# Altium project CC2538+CC2592DK.PrjPcb
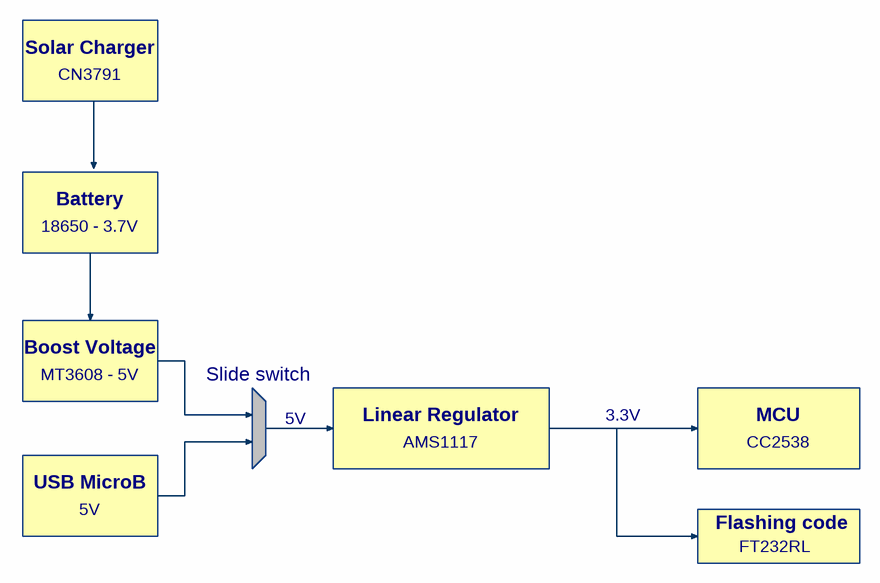
[diagram p0: [CC2538] Power Diagram.SchDoc]
5 sheets, 70 parts. Net scope: global (net labels, ports and power ports of the same name join across sheets).
Board files: [CC2538] PCB.PcbDoc, [CC2538] PCB Print.PcbDoc, [CC2538] PCB v2.PcbDoc, [CC2538] PCB v3.PcbDoc
Sheets:
  [CC2538] Power Diagram.SchDoc
  [CC2538] Power Circuit.SchDoc
  [CC2538] Flashing - FTDI.SchDoc
  [CC2538] MCU.SchDoc
  [CC2538] RTC.SchDoc

## Sheet [CC2538] Power Diagram.SchDoc
size 254 x 208 mm; Date: 10/04/2024; DrawnBy: TinhChau; Revision: 1; SheetNumber: 1; SheetTotal: 4

### Notes on the sheet
- Solar Charger
- CN3791
- Battery
- 18650 - 3.7V
- Boost Voltage
- MT3608 - 5V
- Slide switch
- 5V
- Linear Regulator
- 3.3V
- MCU
- USB MicroB
- AMS1117
- CC2538
- FT232RL
- Flashing code
- Title
- Size
- Date:
- A4
- Number
- Check by:
- Revision
- Sheet of:
- Draw by:

## Sheet [CC2538] Power Circuit.SchDoc
size 254 x 208 mm
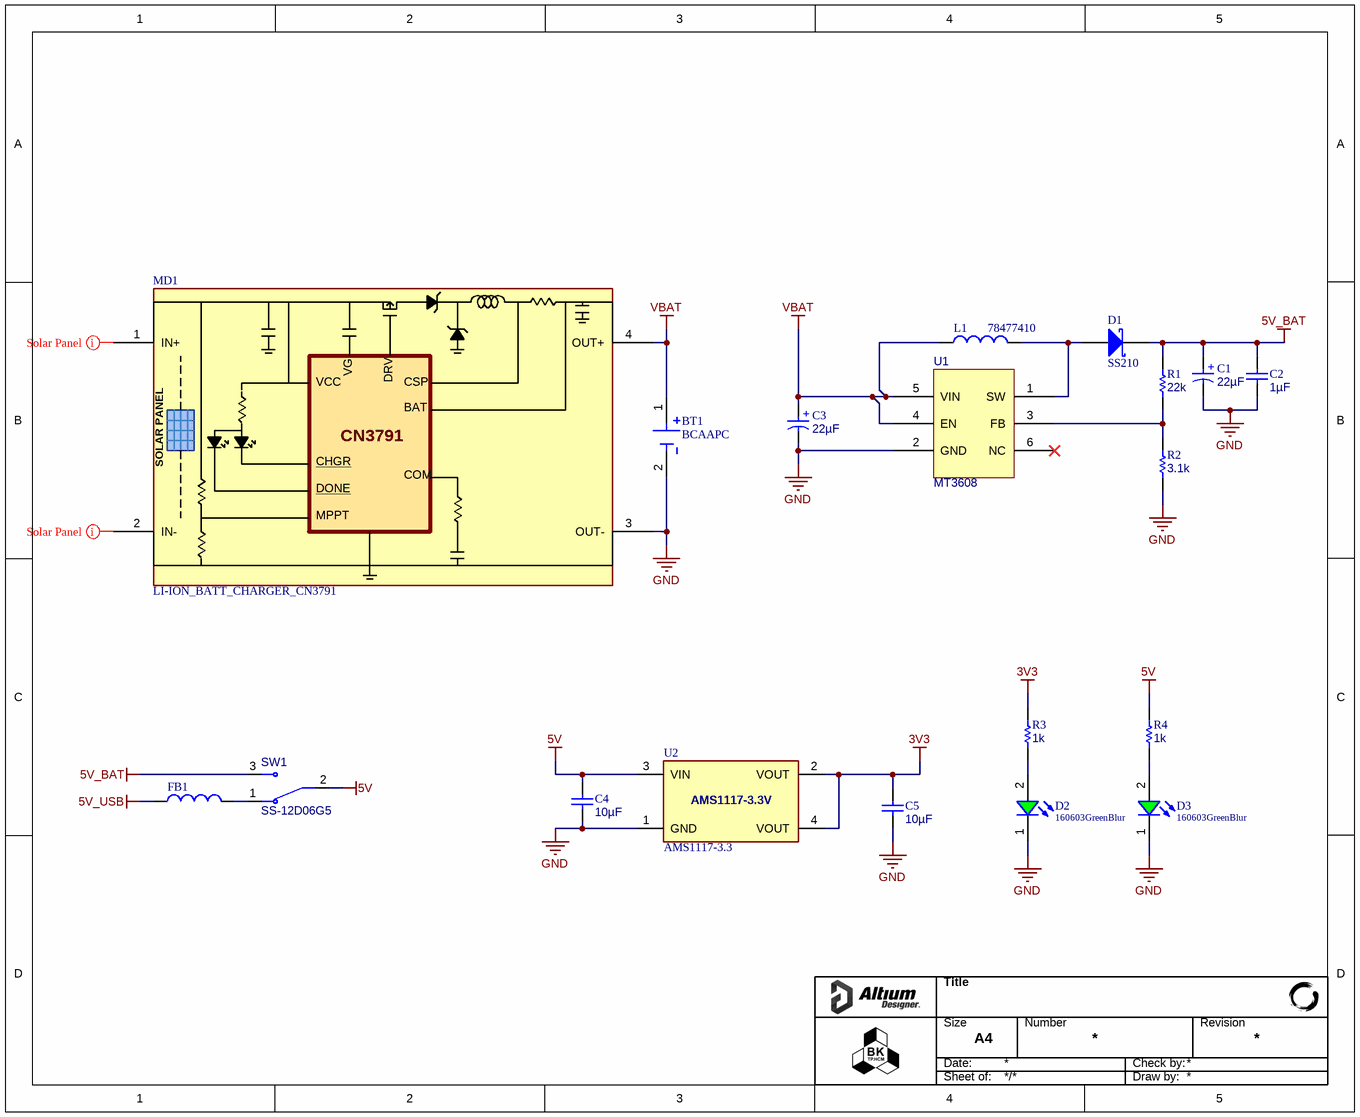
[diagram p1: [CC2538] Power Circuit.SchDoc]

### Parts
BT1  BCAAPC  [BCAAC]
C1  value 22µF  [WCAP-ASLI_D4H5.5]  (hidden comment: 865080340003)
C2  value 1µF  [CAP_0603]  (hidden comment: 0106031051016)
C3  value 22µF  [WCAP-ASLI_D4H5.5]  (hidden comment: 865080340003)
C4  value 10µF  [CAP_0603]  (hidden comment: 0106031061010)
C5  value 10µF  [CAP_0603]  (hidden comment: 0106031061010)
D1  SS210  [SS210-Footprint-SMA]
D2  160603GreenBlur  [WL-SMCW_0603_H=0.7mm]
D3  160603GreenBlur  [WL-SMCW_0603_H=0.7mm]
FB1  CBG160808U601T  [CBG160808U601T-Footprint]  (value not drawn)
L1  78477410  [WE-PD2A_4D28 (4730)]
MD1  LI-ION_BATT_CHARGER_CN3791  [LI-ION_BATT_CHARGER_CN3791-Footprint-1]
R1  value 22k  [RES_0603]  (hidden comment: 0006032231)
R2  value 3.1k  [RES_0603]  (hidden comment: 0006033121)
R3  value 1k  [RES_0603]  (hidden comment: 0006031021)
R4  value 1k  [RES_0603]  (hidden comment: 0006031021)
SW1  SS-12D06G5  [SS-12D06G5-Footprint]
U1  MT3608  [SOT95P280X145-6N]
U2  AMS1117-3.3  [FP-AMS1117-IPC_B]

### Nets
3V3: C5.2 R3.2 U2.2(VOUT) U2.4(VOUT)
5V: C4.2 R4.2 SW1.2 U2.3(VIN)
5V_BAT: C1.1(P) C2.2 D1.2(K) R1.2 SW1.3
5V_USB: FB1.1
GND: BT1.2(NEG) C1.2(N) C2.1 C3.2(N) C4.1 C5.1 D2.1(K) D3.1(K) MD1.3(OUT-) R2.1 U1.2(GND) U2.1(GND)
VBAT: BT1.1(POS) C3.1(P) L1.1 MD1.4(OUT+) U1.4(EN) U1.5(VIN)
NetD1_1: D1.1(A) L1.2 U1.1(SW)
NetD2_2: D2.2(A) R3.1
NetD3_2: D3.2(A) R4.1
NetFB1_2: FB1.2 SW1.1
NetR1_1: R1.1 R2.2 U1.3(FB)

Not connected (* = marked no-connect by the designer): MD1 1(IN+) 2(IN-); U1 6(NC)*

### Layout directives
mark named Solar Panel: NetMD1_1, NetMD1_2

### Notes on the sheet
- Inductor Selection
  The  recommended  values  of  inductor  are 4.7 to 22μH. Small size and better efficiency are the major concerns for portable device, such as MT3608 used for mobile phone. The inductor should have low core loss at 1.2MHz and low DCR for better efficiency. To avoid  inductor  saturation  current  rating  should  be  considered
- Diode Selection
  Schottky diode   is   a   good   choice   for   MT3608because  of  its  low  forward  voltage  drop  and  fast  reverses  recovery.  Using  Schottky  diode  can  get  better efficiency. The high speed rectification is also a  good  characteristic  of  Schottky  diode  for  high  switching frequency.
- (near U1) Capacitor Selection
  Input  and  output  ceramic  capacitors  of  22μF are recommended  for  MT3608  applications.
  The diode’ s reverse breakdown voltage should be larger than the output voltage
- (near R2) Output Voltage
  The  internal  reference VREF  is 0.6V (Typical).The output voltage is divided by a resistor divider,R1 and R2 to the FB pin. The output voltage is given by:
  VOUT=VREF(1+ROUT/RGND)
  Output Voltage: 5V
  VREF: 0.6V
- Title
- Size
- Date:
- A4
- Number
- Check by:
- Revision
- Sheet of:
- Draw by:
- (in symbol CMP-001-00129-2) +
- (in symbol CMP-019-00052-6) AMS1117-3.3V
- (in symbol CMP-00029-00007-6) VG; DRV; VCC; CSP; BAT; CN3791; SOLAR PANEL; CHGR; COM; DONE; MPPT

### Library data of the parts
BT1 = CMP-00029-00002-3: Battery Holder (Open) AA 1 Cell PC Pin; Supplier Locally Name: Thegioiic; Supplier Locally URL: https://www.thegioiic.com/hop-pin-1xaa-xuyen-lo-han-pcb
C1 C3 = CMP-001-00129-2: V-Chip, D4 x H5.5mm, 22uF, 16V; Manufacturer: Wurth Elektronik; Leakage Current: 3.52uA; Endurance: 2000h; Dissipation Factor: 16%; Capacitance Tolerance: +/-20%; Ripple Current: 90mA; Source: Al_Cap.SchLib; Supplier 1 URL: https://www.mouser.com/ProductDetail/Wurth-Elektronik/865080340003?qs=0KOYDY2FL2%252BowmC4S50IuQ%3D%3D; Supplier 2 URL: N/A; Supplier 3 SN: N/A; Pins: 2; Packaging: Tape and Reel; Manufacturer Part Number: N/A; Supplier 1 Name: Mouser; Operating Temperature Max: 105°C; Supplier 2 Name: Digi-Key; Supplier 2 SN: N/A; Design Item ID: 865080340003; Height: 5.5mm; Operating Temperature Min: -55°C; Component Type: Standard; Supplier 3 Name: thegioiic; Supplier 3 URL: https://www.thegioiic.com/tu-nhom-smd-22uf-16v-4x5-4mm; Category: Aluminum Electrolytic Capacitors; Rated Voltage (DC): 16V; Diameter: 4mm; Mount: Surface Mount; Supplier 1 SN: 710-865080340003
C2 = CMP-001-00177-2: CAP, size 0603, 1 uF, 16 VDC, 10%; Manufacturer Part Number: CL10B105KO8NNWC; Manufacturer: Samsung Electro-Mechanics; Voltage Rating DC: 16 VDC; Component Type: Standard; Supplier 3 URL: https://www.thegioiic.com/tu-gom-0603-1uf-16v; Operating Temperature Max: + 85 C; Tolerance: 10%; Supplier 3 Part Number: N/A; Source: Capacitor_0603_10_percent.SchLib; Case/Package: 0603; Supplier 1 Part Number: 187-CL10B105KO8NNWC; Operating Temperature Min: - 40 C; Packaging: Tape and Reel; Design Item ID: 0106031051016; LCSC Part #: C1592; Supplier 2 Part Number: 1276-CL10B105KO8NNWCTR-ND; Supplier 2 URL: https://www.digikey.com/en/products/detail/samsung-electro-mechanics/cl10b105ko8nnwc/16572783; Supplier 1 URL: https://www.mouser.vn/ProductDetail/Samsung-Electro-Mechanics/CL10B105KO8NNWC?qs=81r%252BiQLm7BT%252BXtc72qn1ug%3D%3D&utm_source=mouser-refine-download&utm_medium=file&utm_campaign=CL10B105KO8NNWC&utm_content=Samsung-Electro-Mechanics; ComponentLink1URL: https://www.mouser.vn/datasheet/2/585/Samsung_MLCC_1837944-1929650.pdf; Pins: 2; Mount: SMD/SMT; ComponentLink1Description: Datasheet
C4 C5 = CMP-001-00181-2: CAP, size 0603, 10 uF, 10 VDC, 10%; Manufacturer: Samsung Electro-Mechanics; Manufacturer Part Number: CL10A106KP8NNNC; Voltage Rating DC: 10 VDC; Supplier 2 Part Number: 1276-1192-2-ND; Pins: 2; Design Item ID: 0106031061010; Supplier 2 URL: https://www.digikey.com/en/products/detail/samsung-electro-mechanics/cl10a106kp8nnnc/3886850; Source: Capacitor_0603_10_percent.SchLib; Component Type: Standard; Operating Temperature Min: - 40 C; Packaging: Tape and Reel; Supplier 3 Part Number: N/A; Supplier 1 URL: https://www.mouser.vn/ProductDetail/Samsung-Electro-Mechanics/CL10A106KP8NNNC?qs=X6jEic%2FHinAlyfRHj7fKwg%3D%3D; LCSC Part #: C19702; Supplier 3 URL: https://www.thegioiic.com/tu-gom-0603-10uf-25v; ComponentLink1Description: Datasheet; Operating Temperature Max: + 85 C; ComponentLink1URL: https://www.mouser.vn/datasheet/2/585/MLCC-1837944.pdf; Mount: SMD/SMT; Case/Package: 0603; Supplier 1 Part Number: 187-CL10A106KP8NNNC; Tolerance: 10%
D1 = CMP-004-00056-1: Rectifier Diode, Schottky, 1 Phase, 1 Element, 1.5A, 100V V(RRM), Silicon, DO-214AA; Forward Voltage: 430mV; Max Operating Temperature: 150°C; Min Operating Temperature: -55°C; RoHS Compliant: Yes; Pins: 2
D2 D3 = CMP-004-00033-2: WL-SMCW SMT Mono-color Chip LED Blur, size 0603, Green, 3.2V, 140deg; ComponentLink1URL: N/A; ComponentLink4Description: Supplier 3 URL; Value: Green, 3.2V; ComponentLink2Description: Supplier 1 URL; Supplier 1 Name: Mouser; Supplier 1 SN: 755-SMLD12EN1WT86; Supplier 3 URL: N/A; Design Item ID: 160603GreenBlur; Supplier 3 Name: ICDayRoi; ComponentLink4URL: N/A; Color: Green; Pins: 2; Supplier 1 URL: https://www.mouser.vn/ProductDetail/ROHM-Semiconductor/SMLD12EN1WT86?qs=qSfuJ%252Bfl%2Fd4fR%252B9yZydIwg%3D%3D; Size: 0603; ComponentLink3Description: Supplier 2 URL; Type: Blur; Supplier 2 Name: Digi-Key; Supplier 2 SN: 511-1578-2-ND; Component Type: Standard; ComponentLink3URL: https://www.digikey.com/en/products/detail/rohm-semiconductor/SML-D12M8WT86/1641797; ComponentLink2URL: https://www.mouser.vn/ProductDetail/ROHM-Semiconductor/SMLD12EN1WT86?qs=qSfuJ%252Bfl%2Fd4fR%252B9yZydIwg%3D%3D; Source: WL-SMCW_0603.SchLib; Supplier 3 SN: N/A; Supplier 2 URL: https://www.digikey.com/en/products/detail/rohm-semiconductor/SML-D12M8WT86/1641797; ComponentLink1Description: Datasheet link
FB1 = CMP-006-00022-1: 0603 600Ω ±25% DCR=0.5Ω 0.2A
L1 = CMP-006-00021-3: General Purpose Inductor; RoHS Compliant: Yes
MD1 = CMP-00029-00007-6: CN3791 MPPT solar charge controller module uses the CN3791 IC which’s a pulse width modulated switch-mode lithium-ion battery charge controller that can be powered by a photovoltaic cell with maximum power point tracking function
R1 = CMP-009-00278-4: RES, size 0603, 22 KOhm, 1/10 W, 1%; Manufacturer: OEM; Rated Power: 1/10 W; Design Item ID: 0006032231; Mount: SMD/SMT; LCSC Part #: N/A; Supplier 1 Part Number: 667-ERJ-UP3F2202V; Supplier 3 URL: N/A; Operating Temperature Max: + 85 C; Tolerance: 1%; Component Type: Standard; Pins: 2; Source: Resistor_0603.SchLib; ComponentLink1URL: https://api.pim.na.industrial.panasonic.com/file_stream/main/fileversion/4484; Operating Temperature Min: - 40 C; Manufacturer Part Number: OEM; Supplier 2 URL: https://www.digikey.com/en/products/detail/panasonic-electronic-components/ERJ-UP3F2202V/12092693; Supplier 2 Part Number: 10-ERJ-UP3F2202VTR-ND 10-ERJ-UP3F2202VCT-ND 10-ERJ-UP3F2202VDKR-ND; Supplier 1 URL: https://www.mouser.vn/ProductDetail/Panasonic/ERJ-UP3F2202V?qs=sGAEpiMZZMvdGkrng054twq3eZrCFN893x5tBCka%252B6wRswHHN2WaIQ%3D%3D; Packaging: Tape and Reel; Case/Package: 0603; ComponentLink1Description: Datasheet; Supplier 3 Part Number: N/A
R2 = CMP-009-00309-4: RES, size 0603, 3.1  KOhm, 1/10 W, 1%; Manufacturer Part Number: OEM; Rated Power: 1/10 W; LCSC Part #: N/A; Mount: SMD/SMT; Supplier 2 URL: https://www.digikey.com/en/products/detail/vishay-beyschlag-draloric-bc-components/MCT06030C3101FP500/8124767; Supplier 1 URL: https://www.mouser.vn/ProductDetail/Bourns/CHP0603-FX-3011ELF?qs=gZXFycFWdAOzN1n7XWkwdg%3D%3D; Case/Package: 0603; ComponentLink1Description: Datasheet; ComponentLink1URL: N/A; Tolerance: 1%; Supplier 3 Part Number: N/A; Supplier 3 URL: N/A; Supplier 2 Part Number: MCT06030C3101FP500-ND; Design Item ID: 0006033121; Operating Temperature Max: + 85 C; Packaging: Tape and Reel; Operating Temperature Min: - 40 C; Source: Resistor_0603.SchLib; Component Type: Standard; Supplier 1 Part Number: 652-CHP0603FX3011ELF; Manufacturer: OEM; Pins: 2
R3 R4 = CMP-009-00185-4: RES, size 0603, 1 KOhm, 1/10 W, 1%; Manufacturer Part Number: RC0603FR-071KL; Manufacturer: YAGEO; Rated Power: 1/10 W; Tolerance: 1%; Supplier 1 URL: https://www.mouser.vn/ProductDetail/YAGEO/RC0603FR-071KL?qs=VU8sRB4EgwApHsk4rF%2F3zg%3D%3D; ComponentLink1URL: https://www.yageo.com/upload/media/product/productsearch/datasheet/rchip/PYu-SR_20105_RoHS_L_10.pdf; Supplier 3 URL: N/A; Case/Package: 0603; Supplier 2 URL: https://www.digikey.com/en/products/detail/yageo/rc0603fr-071kl/726843; Mount: SMD/SMT; Supplier 2 Part Number: 311-1.00KHRTR-ND; Source: Resistor_0603.SchLib; Packaging: Tape and Reel; Component Type: Standard; Design Item ID: 0006031021; ComponentLink1Description: Datasheet; Operating Temperature Max: + 85 C; Supplier 3 Part Number: N/A; Operating Temperature Min: - 40 C; LCSC Part #: C22548; Supplier 1 Part Number: 603-RC0603FR-071KL; Pins: 2
SW1 = CMP-011-00018-1
U1 = CMP-019-00055-2: 1.2MHz 2A Vi=2V~24V Vo=28V(Max); Max Supply Voltage: 24V; Min Supply Voltage: 2V; Max Operating Temperature: 85°C; Locally Supplier Name: Thegioiic; Case/Package: SOT23-6; Mounting Technology: SMT; Frequency: 1.2MHz; Locally Supplier URL: https://www.thegioiic.com/mt3608-ic-dieu-chinh-tang-ap-2a-sot-23-6; Min Operating Temperature: -40°C
U2 = CMP-019-00052-6: Fixed Positive LDO Regulator, 3.3V, 1.3V Dropout, PDSO3; Min Supply Voltage: 4.8V; Output Current: 1A; Max Supply Voltage: 15V; Locally Supplier URL: https://www.thegioiic.com/ams1117-3-3v-ic-on-ap-3-3v-1a-sot-223; Output Voltage: 3.3V; Locally Supplier Name: Thegioiic; Min Operating Temperature: -40°C; Case/Package: SOT-223; RoHS Compliant: Yes; Pins: 3; Mounting Technology: SMT; Max Operating Temperature: 125°C; Dropout Voltage: 1.3V; Nominal Supply Current: 1A

## Sheet [CC2538] Flashing - FTDI.SchDoc
size 254 x 208 mm
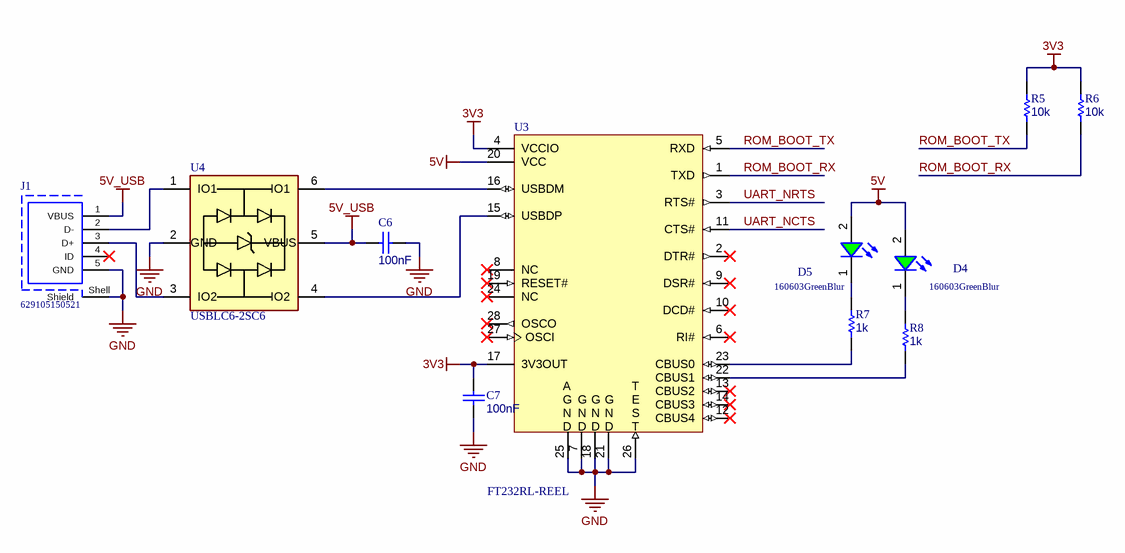
[diagram p2: [CC2538] Flashing - FTDI.SchDoc]

### Parts
C6  value 100nF  [CAP_0603]  (hidden comment: 0106031041050)
C7  value 100nF  [CAP_0603]  (hidden comment: 0106031041050)
D4  160603GreenBlur  [WL-SMCW_0603_H=0.7mm]
D5  160603GreenBlur  [WL-SMCW_0603_H=0.7mm]
J1  629105150521  [629105150521]
R5  value 10k  [RES_0603]  (hidden comment: 0006031031)
R6  value 10k  [RES_0603]  (hidden comment: 0006031031)
R7  value 1k  [RES_0603]  (hidden comment: 0006031021)
R8  value 1k  [RES_0603]  (hidden comment: 0006031021)
U3  FT232RL-REEL  [FTDI-SSOP-28_L]
U4  USBLC6-2SC6  [USBLC6-2SC6-Footprint-1]

### Nets
3V3: C7.2 R5.2 R6.2 U3.4(VCCIO) U3.17(3V3OUT)
5V: D4.2(A) D5.2(A) U3.20(VCC)
5V_USB: C6.2 J1.1(VBUS) U4.5(VBUS)
GND: C6.1 C7.1 J1.5(GND) J1.Shell(Shield) U3.7(GND) U3.18(GND) U3.21(GND) U3.25(AGND) U3.26(TEST) U4.2(GND)
ROM_BOOT_RX: R6.1 U3.1(TXD)
ROM_BOOT_TX: R5.1 U3.5(RXD)
UART_NCTS: U3.11(CTS#)  [project net PA7]
UART_NRTS: U3.3(RTS#)  [project net PA6]
NetD4_1: D4.1(K) R8.2
NetD5_1: D5.1(K) R7.2
NetJ1_2: J1.2(D-) U4.1(IO1)
NetJ1_3: J1.3(D+) U4.3(IO2)
NetR7_1: R7.1 U3.23(CBUS0)
NetR8_1: R8.1 U3.22(CBUS1)
NetU3_15: U3.15(USBDP) U4.4(IO2)
NetU3_16: U3.16(USBDM) U4.6(IO1)

Not connected (* = marked no-connect by the designer): J1 4(ID)*; U3 2(DTR#)* 6(RI#)* 8(NC)* 9(DSR#)* 10(DCD#)* 12(CBUS4)* 13(CBUS2)* 14(CBUS3)* 19(RESET#)* 24(NC)* 27(OSCI)* 28(OSCO)*

### Notes on the sheet
- Title
- Size
- Date:
- A4
- Number
- Check by:
- Revision
- Sheet of:
- Draw by:
- (in symbol CMP-015-00000-6) A / G / N / D; G / N / D; T / E / S / T

### Library data of the parts
C6 C7 = CMP-001-00176-2: CAP, size 0603, 100 nF, 50 VDC, 10%; Manufacturer Part Number: CGA3E3X8R1H104K080AE; Manufacturer: TDK; Voltage Rating DC: 50 VDC; Source: Capacitor_0603_10_percent.SchLib; Operating Temperature Min: - 40 C; Supplier 3 URL: https://www.thegioiic.com/tu-gom-0603-100nf-0-1uf-50v; Supplier 1 Part Number: 810-CGA3E3X8R1H104KA; Mount: SMD/SMT; Supplier 1 URL: https://www.mouser.com/ProductDetail/TDK/CGA3E3X8R1H104K080AE?qs=nQSIdc08i%252Bd8g3IRRgU2bw%3D%3D&utm_source=mouser-refine-download&utm_medium=file&utm_campaign=CGA3E3X8R1H104K080AE&utm_content=TDK; Packaging: Tape and Reel; Supplier 3 Part Number: N/A; LCSC Part #: C14663; ComponentLink1Description: Datasheet; Operating Temperature Max: + 85 C; Design Item ID: 0106031041050; Supplier 2 URL: https://www.digikey.com/en/products/detail/tdk-corporation/cga3e3x8r1h104k080ae/5809262; Component Type: Standard; Supplier 2 Part Number: 445-173697-2-ND; Case/Package: 0603; Tolerance: 10%; ComponentLink1URL: https://product.tdk.com/system/files/dam/doc/product/capacitor/ceramic/mlcc/catalog/mlcc_automotive_soft_en.pdf?ref_disty=mouser; Pins: 2
D4 D5 = CMP-004-00033-2: as D2 on sheet [CC2538] Power Circuit; ComponentLink1URL: N/A; ComponentLink4Description: Supplier 3 URL; Value: Green, 3.2V; ComponentLink2Description: Supplier 1 URL; Supplier 1 Name: Mouser; Supplier 1 SN: 755-SMLD12EN1WT86; Supplier 3 URL: N/A; Design Item ID: 160603GreenBlur; Supplier 3 Name: ICDayRoi; ComponentLink4URL: N/A; Color: Green; Pins: 2; Supplier 1 URL: https://www.mouser.vn/ProductDetail/ROHM-Semiconductor/SMLD12EN1WT86?qs=qSfuJ%252Bfl%2Fd4fR%252B9yZydIwg%3D%3D; Size: 0603; ComponentLink3Description: Supplier 2 URL; Type: Blur; Supplier 2 Name: Digi-Key; Supplier 2 SN: 511-1578-2-ND; Component Type: Standard; ComponentLink3URL: https://www.digikey.com/en/products/detail/rohm-semiconductor/SML-D12M8WT86/1641797; ComponentLink2URL: https://www.mouser.vn/ProductDetail/ROHM-Semiconductor/SMLD12EN1WT86?qs=qSfuJ%252Bfl%2Fd4fR%252B9yZydIwg%3D%3D; Source: WL-SMCW_0603.SchLib; Supplier 3 SN: N/A; Supplier 2 URL: https://www.digikey.com/en/products/detail/rohm-semiconductor/SML-D12M8WT86/1641797; ComponentLink1Description: Datasheet link
J1 = CMP-002-00305-5: Micro USB 2.0 Type B Receptacle WR-COM, Horizontal, SMT, with Pegs, High Current at Pin 1 & Pin 5
R5 R6 = CMP-009-00187-4: RES, size 0603, 10 KOhm, 1/10 W, 1%; Manufacturer Part Number: RC0603FR-0710KL; Manufacturer: YAGEO; Rated Power: 1/10 W; Source: Resistor_0603.SchLib; Pins: 2; Case/Package: 0603; Packaging: Tape and Reel; ComponentLink1Description: Datasheet; Component Type: Standard; Supplier 1 URL: N/A; Design Item ID: 0006031031; Supplier 2 Part Number: 311-10.0KHRTR-ND; Supplier 2 URL: https://www.digikey.com/en/products/detail/yageo/rc0603fr-0710kl/726880; Operating Temperature Max: + 85 C; Mount: SMD/SMT; Supplier 3 URL: N/A; Supplier 1 Part Number: N/A; Operating Temperature Min: - 40 C; LCSC Part #: C98220; Supplier 3 Part Number: N/A; ComponentLink1URL: https://fscdn.rohm.com/en/products/databook/datasheet/passive/resistor/chip_resistor/esr-e.pdf; Tolerance: 1%
R7 R8 = CMP-009-00185-4: as R3 on sheet [CC2538] Power Circuit; Tolerance: 1%; Supplier 1 URL: https://www.mouser.vn/ProductDetail/YAGEO/RC0603FR-071KL?qs=VU8sRB4EgwApHsk4rF%2F3zg%3D%3D; ComponentLink1URL: https://www.yageo.com/upload/media/product/productsearch/datasheet/rchip/PYu-SR_20105_RoHS_L_10.pdf; Supplier 3 URL: N/A; Case/Package: 0603; Supplier 2 URL: https://www.digikey.com/en/products/detail/yageo/rc0603fr-071kl/726843; Mount: SMD/SMT; Supplier 2 Part Number: 311-1.00KHRTR-ND; Source: Resistor_0603.SchLib; Packaging: Tape and Reel; Component Type: Standard; Design Item ID: 0006031021; ComponentLink1Description: Datasheet; Operating Temperature Max: + 85 C; Supplier 3 Part Number: N/A; Operating Temperature Min: - 40 C; LCSC Part #: C22548; Supplier 1 Part Number: 603-RC0603FR-071KL; Pins: 2
U3 = CMP-015-00000-6: USB UART IC, -0.5 to 6 V, 24 mA, -40 to 85 degC, 28-Pin SSOP, RoHS, Tape and Reel; Manufacturer: Future Technology Devices International (FTDI); Nominal Supply Voltage: 5V; Max Supply Voltage: 5.25V; Min Supply Voltage: 3.3V; Channels: 1; Data Rate: 3Mbps; Max Operating Temperature: 85°C; Pins: 16; Locally Supplier URL: https://www.thegioiic.com/ft232rl-ic-usb-to-serial-uart-28-ssop; RoHS Compliant: True; Packaging: TapeandReel; Min Operating Temperature: -40°C; Interface: UART; Datasheet Version: Rev. 1.04, 02/2006; Locally Supplier Name: Thegioiic; Case/Package: SSOP; Manufacturer URL: http://www.ftdichip.com/; Package Quantity: 2000; Datasheet URL: http://datasheet.octopart.com/FT232RL-FTDI-datasheet-120501.pdf
U4 = CMP-004-00055-2: 17V Clamp 5A (8/20Âµs) Ipp Tvs Diode Surface Mount SOT-23-6

## Sheet [CC2538] MCU.SchDoc
size 254 x 208 mm
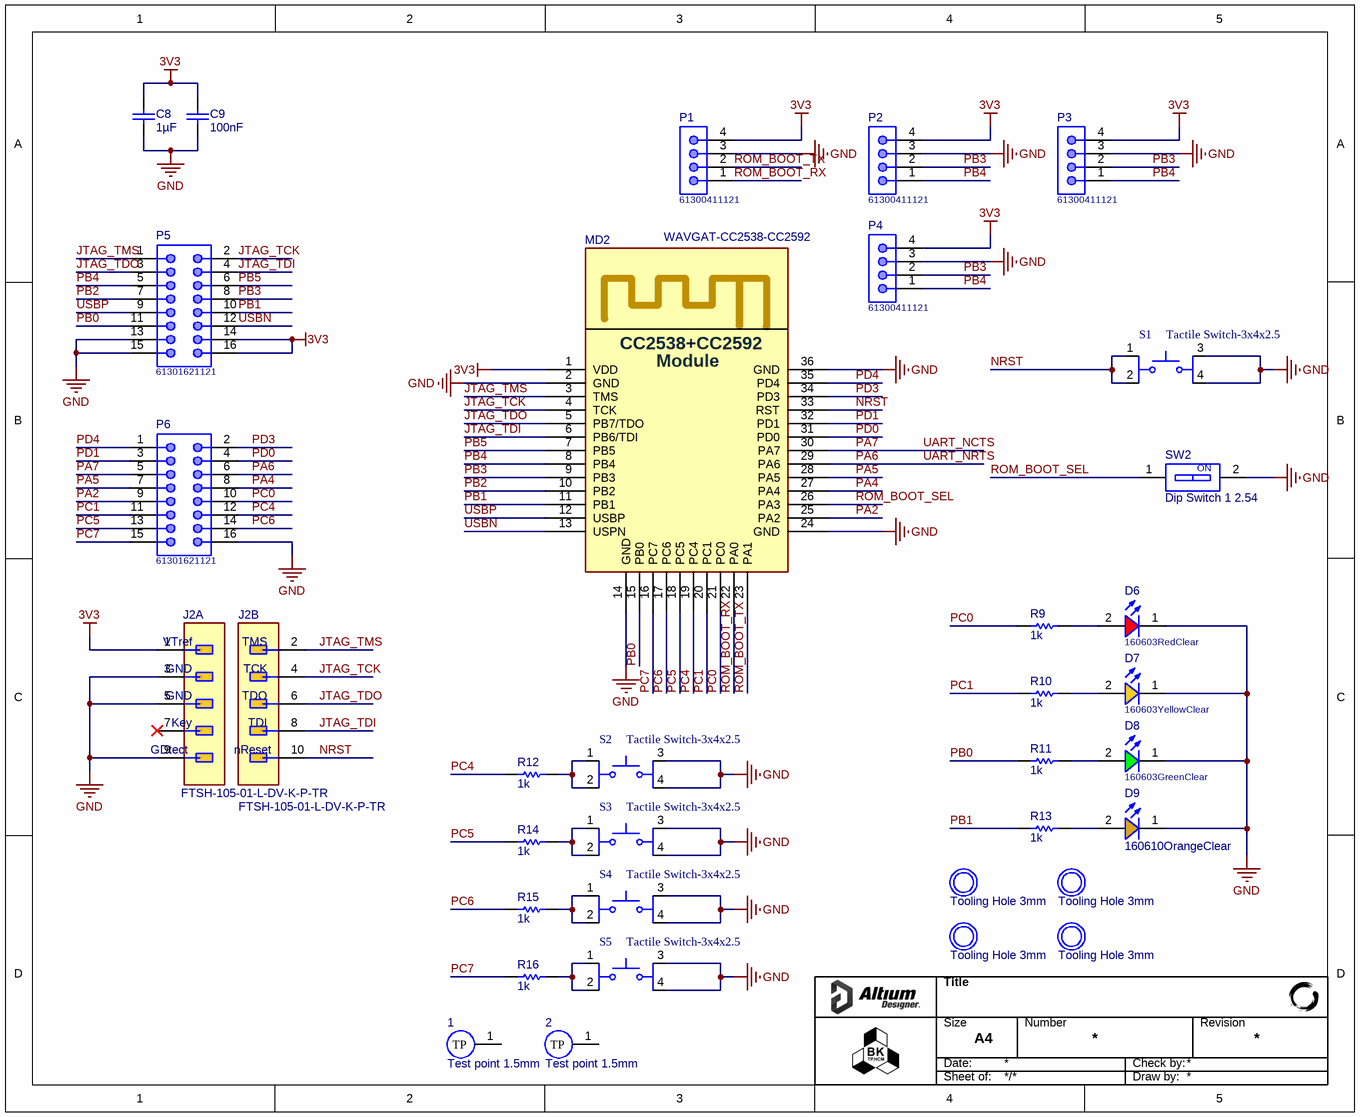
[diagram p3: [CC2538] MCU.SchDoc]

### Parts
1  Test point 1.5mm  [Test point 1.5mm-Footprint-1]
2  Test point 1.5mm  [Test point 1.5mm-Footprint-1]
C8  value 1µF  [CAP_0603]  (hidden comment: 0106031051016)
C9  value 100nF  [CAP_0603]  (hidden comment: 0106031041050)
D6  160603RedClear  [WL-SMCW_0603_H=0.7mm]
D7  160603YellowClear  [WL-SMCW_0603_H=0.7mm]
D8  160603GreenClear  [WL-SMCW_0603_H=0.7mm]
D9  160610OrangeClear  [WL-SMCW_0603_H=0.7mm]
H1  Tooling Hole 3mm  [3mm]  (no BOM)
H2  Tooling Hole 3mm  [3mm]  (no BOM)
H3  Tooling Hole 3mm  [3mm]  (no BOM)
H4  Tooling Hole 3mm  [3mm]  (no BOM)
J2  FTSH-105-01-L-DV-K-P-TR  [FP-FTSH-105-01-L-DV-K-P-T-MFG]  (parts A,B of 2)
MD2  WAVGAT-CC2538-CC2592  [WAVGAT-CC2538-CC2592-Footprint]
P1  61300411121  [61300411121]
P2  61300411121  [61300411121]
P3  61300411121  [61300411121]
P4  61300411121  [61300411121]
P5  61301621121  [61301621121]
P6  61301621121  [61301621121]
R9  value 1k  [RES_0603]  (hidden comment: 0006031021)
R10  value 1k  [RES_0603]  (hidden comment: 0006031021)
R11  value 1k  [RES_0603]  (hidden comment: 0006031021)
R12  value 1k  [RES_0603]  (hidden comment: 0006031025)
R13  value 1k  [RES_0603]  (hidden comment: 0006031021)
R14  value 1k  [RES_0603]  (hidden comment: 0006031025)
R15  value 1k  [RES_0603]  (hidden comment: 0006031025)
R16  value 1k  [RES_0603]  (hidden comment: 0006031025)
S1  Tactile Switch-3x4x2.5  [Tactile Switch-3x4x2.5 Footprint]
S2  Tactile Switch-3x4x2.5  [Tactile Switch-3x4x2.5 Footprint]
S3  Tactile Switch-3x4x2.5  [Tactile Switch-3x4x2.5 Footprint]
S4  Tactile Switch-3x4x2.5  [Tactile Switch-3x4x2.5 Footprint]
S5  Tactile Switch-3x4x2.5  [Tactile Switch-3x4x2.5 Footprint]
SW2  Dip Switch 1 2.54  [Dip Switch 1 2.54-Footprint-1]

### Nets
3V3: C8.2 C9.2 J2.1(VTref) MD2.1(VDD) P1.4 P2.4 P3.4 P4.4 P5.14 P5.16
GND: C8.1 C9.1 D6.1(K) D7.1(K) D8.1(K) D9.1(K) J2.3 J2.5 J2.9 MD2.2(GND) MD2.14(GND) MD2.24(GND) MD2.36(GND) P1.3 P2.3 P3.3 P4.3 P5.13 P5.15 P6.16 S1.3 S1.4 S2.3 S2.4 S3.3 S3.4 S4.3 S4.4 S5.3 S5.4 SW2.2
JTAG_TCK: J2.4 MD2.4(TCK) P5.2
JTAG_TDI: J2.8 MD2.6(PB6/TDI) P5.4
JTAG_TDO: J2.6 MD2.5(PB7/TDO) P5.3
JTAG_TMS: J2.2(VTref) MD2.3(TMS) P5.1
NRST: J2.10 MD2.33(RST) S1.1 S1.2
PA2: MD2.25(PA2) P6.9
PA4: MD2.27(PA4) P6.8
PA5: MD2.28(PA5) P6.7
PA6: MD2.29(PA6) P6.6  [also labelled UART_NRTS]
PA7: MD2.30(PA7) P6.5  [also labelled UART_NCTS]
PB0: MD2.15(PB0) P5.11 R11.1
PB1: MD2.11(PB1) P5.10 R13.1
PB2: MD2.10(PB2) P5.7
PB3: MD2.9(PB3) P2.2 P3.2 P4.2 P5.8
PB4: MD2.8(PB4) P2.1 P3.1 P4.1 P5.5
PB5: MD2.7(PB5) P5.6
PC0: MD2.21(PC0) P6.10 R9.1
PC1: MD2.20(PC1) P6.11 R10.1
PC4: MD2.19(PC4) P6.12 R12.1
PC5: MD2.18(PC5) P6.13 R14.1
PC6: MD2.17(PC6) P6.14 R15.1
PC7: MD2.16(PC7) P6.15 R16.1
PD0: MD2.31(PD0) P6.4
PD1: MD2.32(PD1) P6.3
PD3: MD2.34(PD3) P6.2
PD4: MD2.35(PD4) P6.1
ROM_BOOT_RX: MD2.22(PA0) P1.1
ROM_BOOT_SEL: MD2.26(PA3) SW2.1
ROM_BOOT_TX: MD2.23(PA1) P1.2
USBN: MD2.13(USPN) P5.12
USBP: MD2.12(USBP) P5.9
NetD6_2: D6.2(A) R9.2
NetD7_2: D7.2(A) R10.2
NetD8_2: D8.2(A) R11.2
NetD9_2: D9.2(A) R13.2
NetR12_2: R12.2 S2.1 S2.2
NetR14_2: R14.2 S3.1 S3.2
NetR15_2: R15.2 S4.1 S4.2
NetR16_2: R16.2 S5.1 S5.2

Not connected (* = marked no-connect by the designer): 1 1(TP); 2 1(TP); J2 7*

### Notes on the sheet
- Title
- Size
- Date:
- A4
- Number
- Check by:
- Revision
- Sheet of:
- Draw by:
- (in symbol CMP-002-00347-1, part A) GND; Key; GDtect
- (in symbol CMP-002-00347-1, part B) TMS; TCK; TDO; TDI; nReset
- (in symbol CMP-011-00016-1) ON
- (in symbol CMP-021-00009-2) CC2538+CC2592; Module

### Library data of the parts
1 2 = CMP-00028-00008-2: Test point, 1.5mm radius
C8 = CMP-001-00177-2: as C2 on sheet [CC2538] Power Circuit; Component Type: Standard; Supplier 3 URL: https://www.thegioiic.com/tu-gom-0603-1uf-16v; Operating Temperature Max: + 85 C; Tolerance: 10%; Supplier 3 Part Number: N/A; Source: Capacitor_0603_10_percent.SchLib; Case/Package: 0603; Supplier 1 Part Number: 187-CL10B105KO8NNWC; Operating Temperature Min: - 40 C; Packaging: Tape and Reel; Design Item ID: 0106031051016; LCSC Part #: C1592; Supplier 2 Part Number: 1276-CL10B105KO8NNWCTR-ND; Supplier 2 URL: https://www.digikey.com/en/products/detail/samsung-electro-mechanics/cl10b105ko8nnwc/16572783; Supplier 1 URL: https://www.mouser.vn/ProductDetail/Samsung-Electro-Mechanics/CL10B105KO8NNWC?qs=81r%252BiQLm7BT%252BXtc72qn1ug%3D%3D&utm_source=mouser-refine-download&utm_medium=file&utm_campaign=CL10B105KO8NNWC&utm_content=Samsung-Electro-Mechanics; ComponentLink1URL: https://www.mouser.vn/datasheet/2/585/Samsung_MLCC_1837944-1929650.pdf; Pins: 2; Mount: SMD/SMT; ComponentLink1Description: Datasheet
C9 = CMP-001-00176-2: as C6 on sheet [CC2538] Flashing - FTDI; Source: Capacitor_0603_10_percent.SchLib; Operating Temperature Min: - 40 C; Supplier 3 URL: https://www.thegioiic.com/tu-gom-0603-100nf-0-1uf-50v; Supplier 1 Part Number: 810-CGA3E3X8R1H104KA; Mount: SMD/SMT; Supplier 1 URL: https://www.mouser.com/ProductDetail/TDK/CGA3E3X8R1H104K080AE?qs=nQSIdc08i%252Bd8g3IRRgU2bw%3D%3D&utm_source=mouser-refine-download&utm_medium=file&utm_campaign=CGA3E3X8R1H104K080AE&utm_content=TDK; Packaging: Tape and Reel; Supplier 3 Part Number: N/A; LCSC Part #: C14663; ComponentLink1Description: Datasheet; Operating Temperature Max: + 85 C; Design Item ID: 0106031041050; Supplier 2 URL: https://www.digikey.com/en/products/detail/tdk-corporation/cga3e3x8r1h104k080ae/5809262; Component Type: Standard; Supplier 2 Part Number: 445-173697-2-ND; Case/Package: 0603; Tolerance: 10%; ComponentLink1URL: https://product.tdk.com/system/files/dam/doc/product/capacitor/ceramic/mlcc/catalog/mlcc_automotive_soft_en.pdf?ref_disty=mouser; Pins: 2
D6 = CMP-004-00038-2: WL-SMCW SMT Mono-color Chip LED Waterclear, size 0603, Red, 2V, 140deg; Value: Red, 2V; Type: Clear; ComponentLink1Description: Datasheet link; ComponentLink2Description: Supplier 1 URL; Supplier 3 SN: N/A; Design Item ID: 160603RedClear; Source: WL-SMCW_0603.SchLib; Supplier 3 Name: ICDayRoi; Size: 0603; Supplier 1 SN: 710-150060RS75000; Pins: 2; ComponentLink4Description: Supplier 3 URL; Component Type: Standard; ComponentLink2URL: https://www.mouser.vn/ProductDetail/Wurth-Elektronik/150060RS75000?qs=LlUlMxKIyB3QnmZ3fw%2FVCA%3D%3D; Color: Red; ComponentLink3Description: Supplier 2 URL; Supplier 3 URL: https://www.thegioiic.com/led-do-0603-dan-smd-trong-suot; Supplier 2 URL: https://www.digikey.com/en/products/detail/liteon/LTST-C191KRKT/386837; ComponentLink1URL: N/A; ComponentLink3URL: https://www.digikey.com/en/products/detail/liteon/LTST-C191KRKT/386837; ComponentLink4URL: https://www.thegioiic.com/led-do-0603-dan-smd-trong-suot; Supplier 2 Name: Digi-Key; Supplier 1 Name: Mouser; Supplier 1 URL: https://www.mouser.vn/ProductDetail/Wurth-Elektronik/150060RS75000?qs=LlUlMxKIyB3QnmZ3fw%2FVCA%3D%3D; Supplier 2 SN: 160-1447-2-ND
D7 = CMP-004-00042-2: WL-SMCW SMT Mono-color Chip LED Waterclear, size 0603, Yellow, 2V, 140deg; Type: Clear; ComponentLink1Description: Datasheet link; ComponentLink3Description: Supplier 2 URL; Supplier 1 URL: https://www.mouser.com/ProductDetail/Wurth-Elektronik/150060YS75003?qs=Li%252BoUPsLEnvfob7qsAi9dA%3D%3D; Supplier 3 Name: ICDayRoi; Supplier 3 SN: N/A; ComponentLink2URL: https://www.mouser.com/ProductDetail/Wurth-Elektronik/150060YS75003?qs=Li%252BoUPsLEnvfob7qsAi9dA%3D%3D; ComponentLink4Description: Supplier 3 URL; Supplier 3 URL: https://icdayroi.com/led-yellow-0603; ComponentLink1URL: N/A; Source: WL-SMCW_0603.SchLib; Color: Yellow; Design Item ID: 160603YellowClear; Component Type: Standard; Size: 0603; ComponentLink4URL: https://icdayroi.com/led-yellow-0603; ComponentLink2Description: Supplier 1 URL; Supplier 1 Name: Mouser; Supplier 1 SN: 710-150060YS75003; ComponentLink3URL: https://www.digikey.com/en/products/detail/liteon/LTST-C191KSKT/386839; Supplier 2 URL: https://www.digikey.com/en/products/detail/liteon/LTST-C191KSKT/386839; Supplier 2 Name: Digi-Key; Value: Yellow, 2V; Supplier 2 SN: 160-1448-2-ND; Pins: 2
D8 = CMP-004-00034-2: WL-SMCW SMT Mono-color Chip LED Waterclear, size 0603, Green, 3.2V, 140deg; Type: Clear; Size: 0603; Supplier 3 SN: N/A; Supplier 3 URL: https://www.thegioiic.com/led-xanh-la-0603-dan-smd-trong-suot; ComponentLink4Description: Supplier 3 URL; ComponentLink3URL: https://www.digikey.com/en/products/detail/liteon/LTST-C191KGKT/386835; Pins: 2; Supplier 1 SN: 710-150060GS75000; Source: WL-SMCW_0603.SchLib; Supplier 1 Name: Mouser; ComponentLink2URL: https://www.mouser.vn/ProductDetail/Wurth-Elektronik/150060GS75000?qs=LlUlMxKIyB0UYkq5lDO8nA%3D%3D; ComponentLink1URL: N/A; Component Type: Standard; ComponentLink3Description: Supplier 2 URL; Supplier 2 SN: 160-1446-2-ND; Value: Green, 3.2V; Design Item ID: 160603GreenClear; ComponentLink2Description: Supplier 1 URL; Supplier 2 URL: https://www.digikey.com/en/products/detail/liteon/LTST-C191KGKT/386835; ComponentLink4URL: https://www.thegioiic.com/led-xanh-la-0603-dan-smd-trong-suot; ComponentLink1Description: Datasheet link; Supplier 3 Name: ICDayRoi; Supplier 1 URL: https://www.mouser.vn/ProductDetail/Wurth-Elektronik/150060GS75000?qs=LlUlMxKIyB0UYkq5lDO8nA%3D%3D; Supplier 2 Name: Digi-Key; Color: Green
D9 = CMP-007-00036-1: Colour: Orange
H1-H4 = CMP-034-000004-2: Source: Hole.SchLib; Design Item ID: Tooling Hole 3mm; Pin Count: 0; Component Type: Standard (No BOM)
J2 = CMP-002-00347-1: JTAG Connector - Board Connector, 10 Contact(s), 2 Row(s), Male, Straight, 0.05 inch Pitch, Surface Mount Terminal, Locking; RoHS Compliant: Yes; Mounting Technology: Board; Connector Type: BOARD CONNECTOR
MD2 = CMP-021-00009-2: WAVGAT-CC2538-CC2592 Module
P1-P4 = CMP-002-01000-1: WR-PHD Pin Header, THT, pitch 2.54mm, Single Row, Vertical, 4p; Manufacturer: Wurth Elektronik; Contact Resistance: 20mOhm; Value: 3A, 250 V (AC); Withstanding Voltage: 500VAC; Rated Current: 3A; Working Voltage: 250VAC; Pin Number: 4; Supplier 1 URL: https://www.mouser.vn/ProductDetail/Wurth-Elektronik/61300311121?qs=PhR8RmCirEYxRWFJzNKsUw%3D%3D; Pins: 4; Supplier 3 Part Number: N/A; LCSC Part #: N/A; ComponentLink1URL: https://www.we-online.com/catalog/datasheet/61300411121.pdf; Pitch: 2.54mm; Supplier 2 URL: N/A; Packaging: Bag; Gender: Pin Header; Operating Temperature Min: - 25 C; Operating Temperature Max: + 85 C; Source: WR-PHD_Pin Header_2.54mm.SchLib; Orientation: Vertical; Mount: THT; Row Number: Single; Supplier 2 Part Number: N/A; Design Item ID: 61300411121; Published Date: May 2020; Supplier 3 URL: N/A; Component Type: Standard; Supplier 1 Part Number: 710-61300311121; ComponentLink1Description: Datasheet; Manufacturer Part Number: 61300411121
P5 P6 = CMP-002-01084-1: WR-PHD Pin Header, THT, pitch 2.54mm, Dual Row, Vertical, 16p; Manufacturer: Wurth Elektronik; Rated Current: 3A; Working Voltage: 250VAC; Contact Resistance: 20mOhm; Withstanding Voltage: 500VAC; Value: 3A, 250 V (AC); Pin Number: 16; Supplier 2 URL: N/A; Gender: Pin Header; LCSC Part #: N/A; Supplier 1 Part Number: 710-61301621121; Source: WR-PHD_Pin Header_2.54mm.SchLib; Manufacturer Part Number: 61301621121; Operating Temperature Min: - 25 C; Supplier 3 URL: https://www.thegioiic.com/hang-rao-duc-doi-2-54mm-16-chan-2-hang-cao-11-2mm-xuyen-lo; Supplier 2 Part Number: N/A; Published Date: May 2020; Pitch: 2.54mm; ComponentLink1Description: Datasheet; Row Number: Dual; Operating Temperature Max: + 85 C; Orientation: Vertical; Mount: THT; Supplier 3 Part Number: N/A; Packaging: Bag; Supplier 1 URL: https://www.mouser.vn/ProductDetail/Wurth-Elektronik/61301621121?qs=PhR8RmCirEZBHI%2Fm2diuGA%3D%3D; Pins: 16; Design Item ID: 61301621121; Component Type: Standard; ComponentLink1URL: https://www.we-online.com/catalog/datasheet/61301621121.pdf
R9-R11 R13 = CMP-009-00185-4: as R3 on sheet [CC2538] Power Circuit; Tolerance: 1%; Supplier 1 URL: https://www.mouser.vn/ProductDetail/YAGEO/RC0603FR-071KL?qs=VU8sRB4EgwApHsk4rF%2F3zg%3D%3D; ComponentLink1URL: https://www.yageo.com/upload/media/product/productsearch/datasheet/rchip/PYu-SR_20105_RoHS_L_10.pdf; Supplier 3 URL: N/A; Case/Package: 0603; Supplier 2 URL: https://www.digikey.com/en/products/detail/yageo/rc0603fr-071kl/726843; Mount: SMD/SMT; Supplier 2 Part Number: 311-1.00KHRTR-ND; Source: Resistor_0603.SchLib; Packaging: Tape and Reel; Component Type: Standard; Design Item ID: 0006031021; ComponentLink1Description: Datasheet; Operating Temperature Max: + 85 C; Supplier 3 Part Number: N/A; Operating Temperature Min: - 40 C; LCSC Part #: C22548; Supplier 1 Part Number: 603-RC0603FR-071KL; Pins: 2
R12 R14-R16 = CMP-009-00186-4: RES, size 0603, 1 KOhm, 1/10 W, 5%; Manufacturer Part Number: ERJ-UP3J102V; Manufacturer: Panasonic; Rated Power: 1/10 W; Supplier 3 URL: N/A; Tolerance: 5%; Mount: SMD/SMT; ComponentLink1URL: https://www.mouser.vn/datasheet/2/315/Panasonic_Resistors_Thick_Film_Anti_Sulf_Anti_Surg-1825099.pdf; ComponentLink1Description: Datasheet; Operating Temperature Max: + 85 C; Supplier 2 URL: https://www.mouser.vn/ProductDetail/Panasonic/ERJ-UP3J102V?qs=GedFDFLaBXG0ASpYP%252B3phQ%3D%3D; Supplier 1 Part Number: 667-ERJ-UP3J102V; Packaging: Tape and Reel; Supplier 3 Part Number: N/A; Component Type: Standard; Supplier 1 URL: https://www.mouser.vn/ProductDetail/Panasonic/ERJ-UP3J102V?qs=GedFDFLaBXG0ASpYP%252B3phQ%3D%3D; Case/Package: 0603; Pins: 2; Operating Temperature Min: - 40 C; Supplier 2 Part Number: 667-ERJ-UP3J102V; Source: Resistor_0603.SchLib; Design Item ID: 0006031025; LCSC Part #: N/A
S1-S5 = CMP-011-00013-5: Tactile Switch, 3x4x2.5mm; Mounting Technology: SMT; Pins: 4
SW2 = CMP-011-00016-1: Slide Dip Switch, 1 Switches, SPST, Latched, 0.025A, 24VDC, 0 PCB Hole Cnt, Solder Terminal, Surface Mount-straight

## Sheet [CC2538] RTC.SchDoc
size 254 x 208 mm
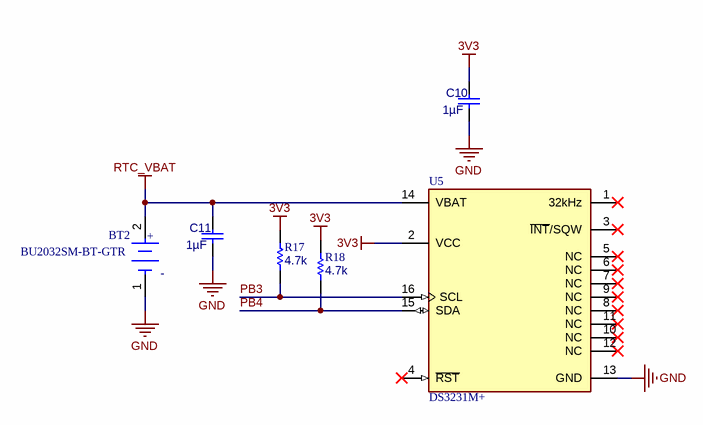
[diagram p4: [CC2538] RTC.SchDoc]

### Parts
BT2  BU2032SM-BT-GTR  [FP-BU2032SM-BT-GTR-MFG]
C10  value 1µF  [CAP_0603]  (hidden comment: 0106031051016)
C11  value 1µF  [CAP_0603]  (hidden comment: 0106031051016)
R17  value 4.7k  [RES_0603]  (hidden comment: 0006034721)
R18  value 4.7k  [RES_0603]  (hidden comment: 0006034721)
U5  DS3231M+  [FP-W16MK-1-IPC_B]

### Nets
3V3: C10.2 R17.2 R18.2 U5.2(VCC)
GND: BT2.1(C) C10.1 C11.1 U5.13(GND)
RTC_VBAT: BT2.2(A) C11.2 U5.14(VBAT)
PB3: R17.1 U5.16(SCL)
PB4: R18.1 U5.15(SDA)

Not connected (* = marked no-connect by the designer): U5 1(32kHz)* 3(~{INT}/SQW)* 4(~{RST})* 5(NC)* 6(NC)* 7(NC)* 8(NC)* 9(NC)* 10(NC)* 11(NC)* 12(NC)*

### Notes on the sheet
- Title
- Size
- Date:
- A4
- Number
- Check by:
- Revision
- Sheet of:
- Draw by:
- (in symbol CMP-00029-00009-1) +; -

### Library data of the parts
BT2 = CMP-00029-00009-1: Batteries/Accessories
C10 C11 = CMP-001-00177-2: as C2 on sheet [CC2538] Power Circuit; Component Type: Standard; Supplier 3 URL: https://www.thegioiic.com/tu-gom-0603-1uf-16v; Operating Temperature Max: + 85 C; Tolerance: 10%; Supplier 3 Part Number: N/A; Source: Capacitor_0603_10_percent.SchLib; Case/Package: 0603; Supplier 1 Part Number: 187-CL10B105KO8NNWC; Operating Temperature Min: - 40 C; Packaging: Tape and Reel; Design Item ID: 0106031051016; LCSC Part #: C1592; Supplier 2 Part Number: 1276-CL10B105KO8NNWCTR-ND; Supplier 2 URL: https://www.digikey.com/en/products/detail/samsung-electro-mechanics/cl10b105ko8nnwc/16572783; Supplier 1 URL: https://www.mouser.vn/ProductDetail/Samsung-Electro-Mechanics/CL10B105KO8NNWC?qs=81r%252BiQLm7BT%252BXtc72qn1ug%3D%3D&utm_source=mouser-refine-download&utm_medium=file&utm_campaign=CL10B105KO8NNWC&utm_content=Samsung-Electro-Mechanics; ComponentLink1URL: https://www.mouser.vn/datasheet/2/585/Samsung_MLCC_1837944-1929650.pdf; Pins: 2; Mount: SMD/SMT; ComponentLink1Description: Datasheet
R17 R18 = CMP-009-00346-4: RES, size 0603, 4.7 kOhm, 1/10 W, 1%; Manufacturer Part Number: RC0603FR-074K7L; Manufacturer: YAGEO; Rated Power: 1/10 W; Design Item ID: 0006034721; Supplier 1 URL: https://www.mouser.vn/ProductDetail/YAGEO/RC0603FR-074K7L?qs=gt6vzsuosg37y0l7Vt36bQ%3D%3D; Source: Resistor_0603.SchLib; Supplier 2 URL: N/A; LCSC Part #: C99782; Supplier 2 Part Number: N/A; Supplier 1 Part Number: 603-RC0603FR-074K7L; Pins: 2; Packaging: Tape and Reel; ComponentLink1URL: https://www.mouser.vn/datasheet/2/447/YAGEO_PYu_RC_Group_51_RoHS_L_12-3313492.pdf; Supplier 3 Part Number: N/A; Component Type: Standard; Operating Temperature Max: + 85 C; Supplier 3 URL: N/A; Operating Temperature Min: - 40 C; Case/Package: 0603; ComponentLink1Description: Datasheet; Tolerance: 1%; Mount: SMD/SMT
U5 = CMP-00023-00003-1: Real Time Clock, Non-Volatile, 1 Timer(s), CMOS, PDSO16; Case/Package: SOP; Max Operating Temperature: 85°C; RoHS Compliant: Yes; Min Operating Temperature: -40°C; Pins: 16

## Nets that join several sheets
3V3: [CC2538] Power Circuit (C5.2 R3.2 U2.2 U2.4), [CC2538] Flashing - FTDI (5 pins), [CC2538] MCU (10 pins), [CC2538] RTC (C10.2 R17.2 R18.2 U5.2)
5V: [CC2538] Power Circuit (C4.2 R4.2 SW1.2 U2.3), [CC2538] Flashing - FTDI (D4.2 D5.2 U3.20)
5V_USB: [CC2538] Power Circuit (FB1.1), [CC2538] Flashing - FTDI (C6.2 J1.1 U4.5)
GND: [CC2538] Power Circuit (12 pins), [CC2538] Flashing - FTDI (10 pins), [CC2538] MCU (31 pins), [CC2538] RTC (BT2.1 C10.1 C11.1 U5.13)
PA6: [CC2538] Flashing - FTDI (U3.3), [CC2538] MCU (MD2.29 P6.6)
PA7: [CC2538] Flashing - FTDI (U3.11), [CC2538] MCU (MD2.30 P6.5)
PB3: [CC2538] MCU (5 pins), [CC2538] RTC (R17.1 U5.16)
PB4: [CC2538] MCU (5 pins), [CC2538] RTC (R18.1 U5.15)
ROM_BOOT_RX: [CC2538] Flashing - FTDI (R6.1 U3.1), [CC2538] MCU (MD2.22 P1.1)
ROM_BOOT_TX: [CC2538] Flashing - FTDI (R5.1 U3.5), [CC2538] MCU (MD2.23 P1.2)